# Altium schematic sheet DDS_channel.SchDoc: 9910 & 9912 DDS
size 420 x 297 mm; Author: G.K.; CompanyName: WUT; DrawnBy: G.K.; Organization: WUT ISE; Address1: Warsaw Univeristy of Technology; Address2: Nowowiejska 15/19; DocumentNumber: 5; Revision: -; SheetNumber: 5; SheetTotal: 7; EDA_Number: ARTIQ; Projet: ARTIQ/SINARA; ModifiedBy: -; CreateDate: XX/XX/XXXX; CheckedDate: -; DivGrp: ISE; Designer: G.K.; ModifiedDate: -; ProjectName: ARTIQ/SINARA
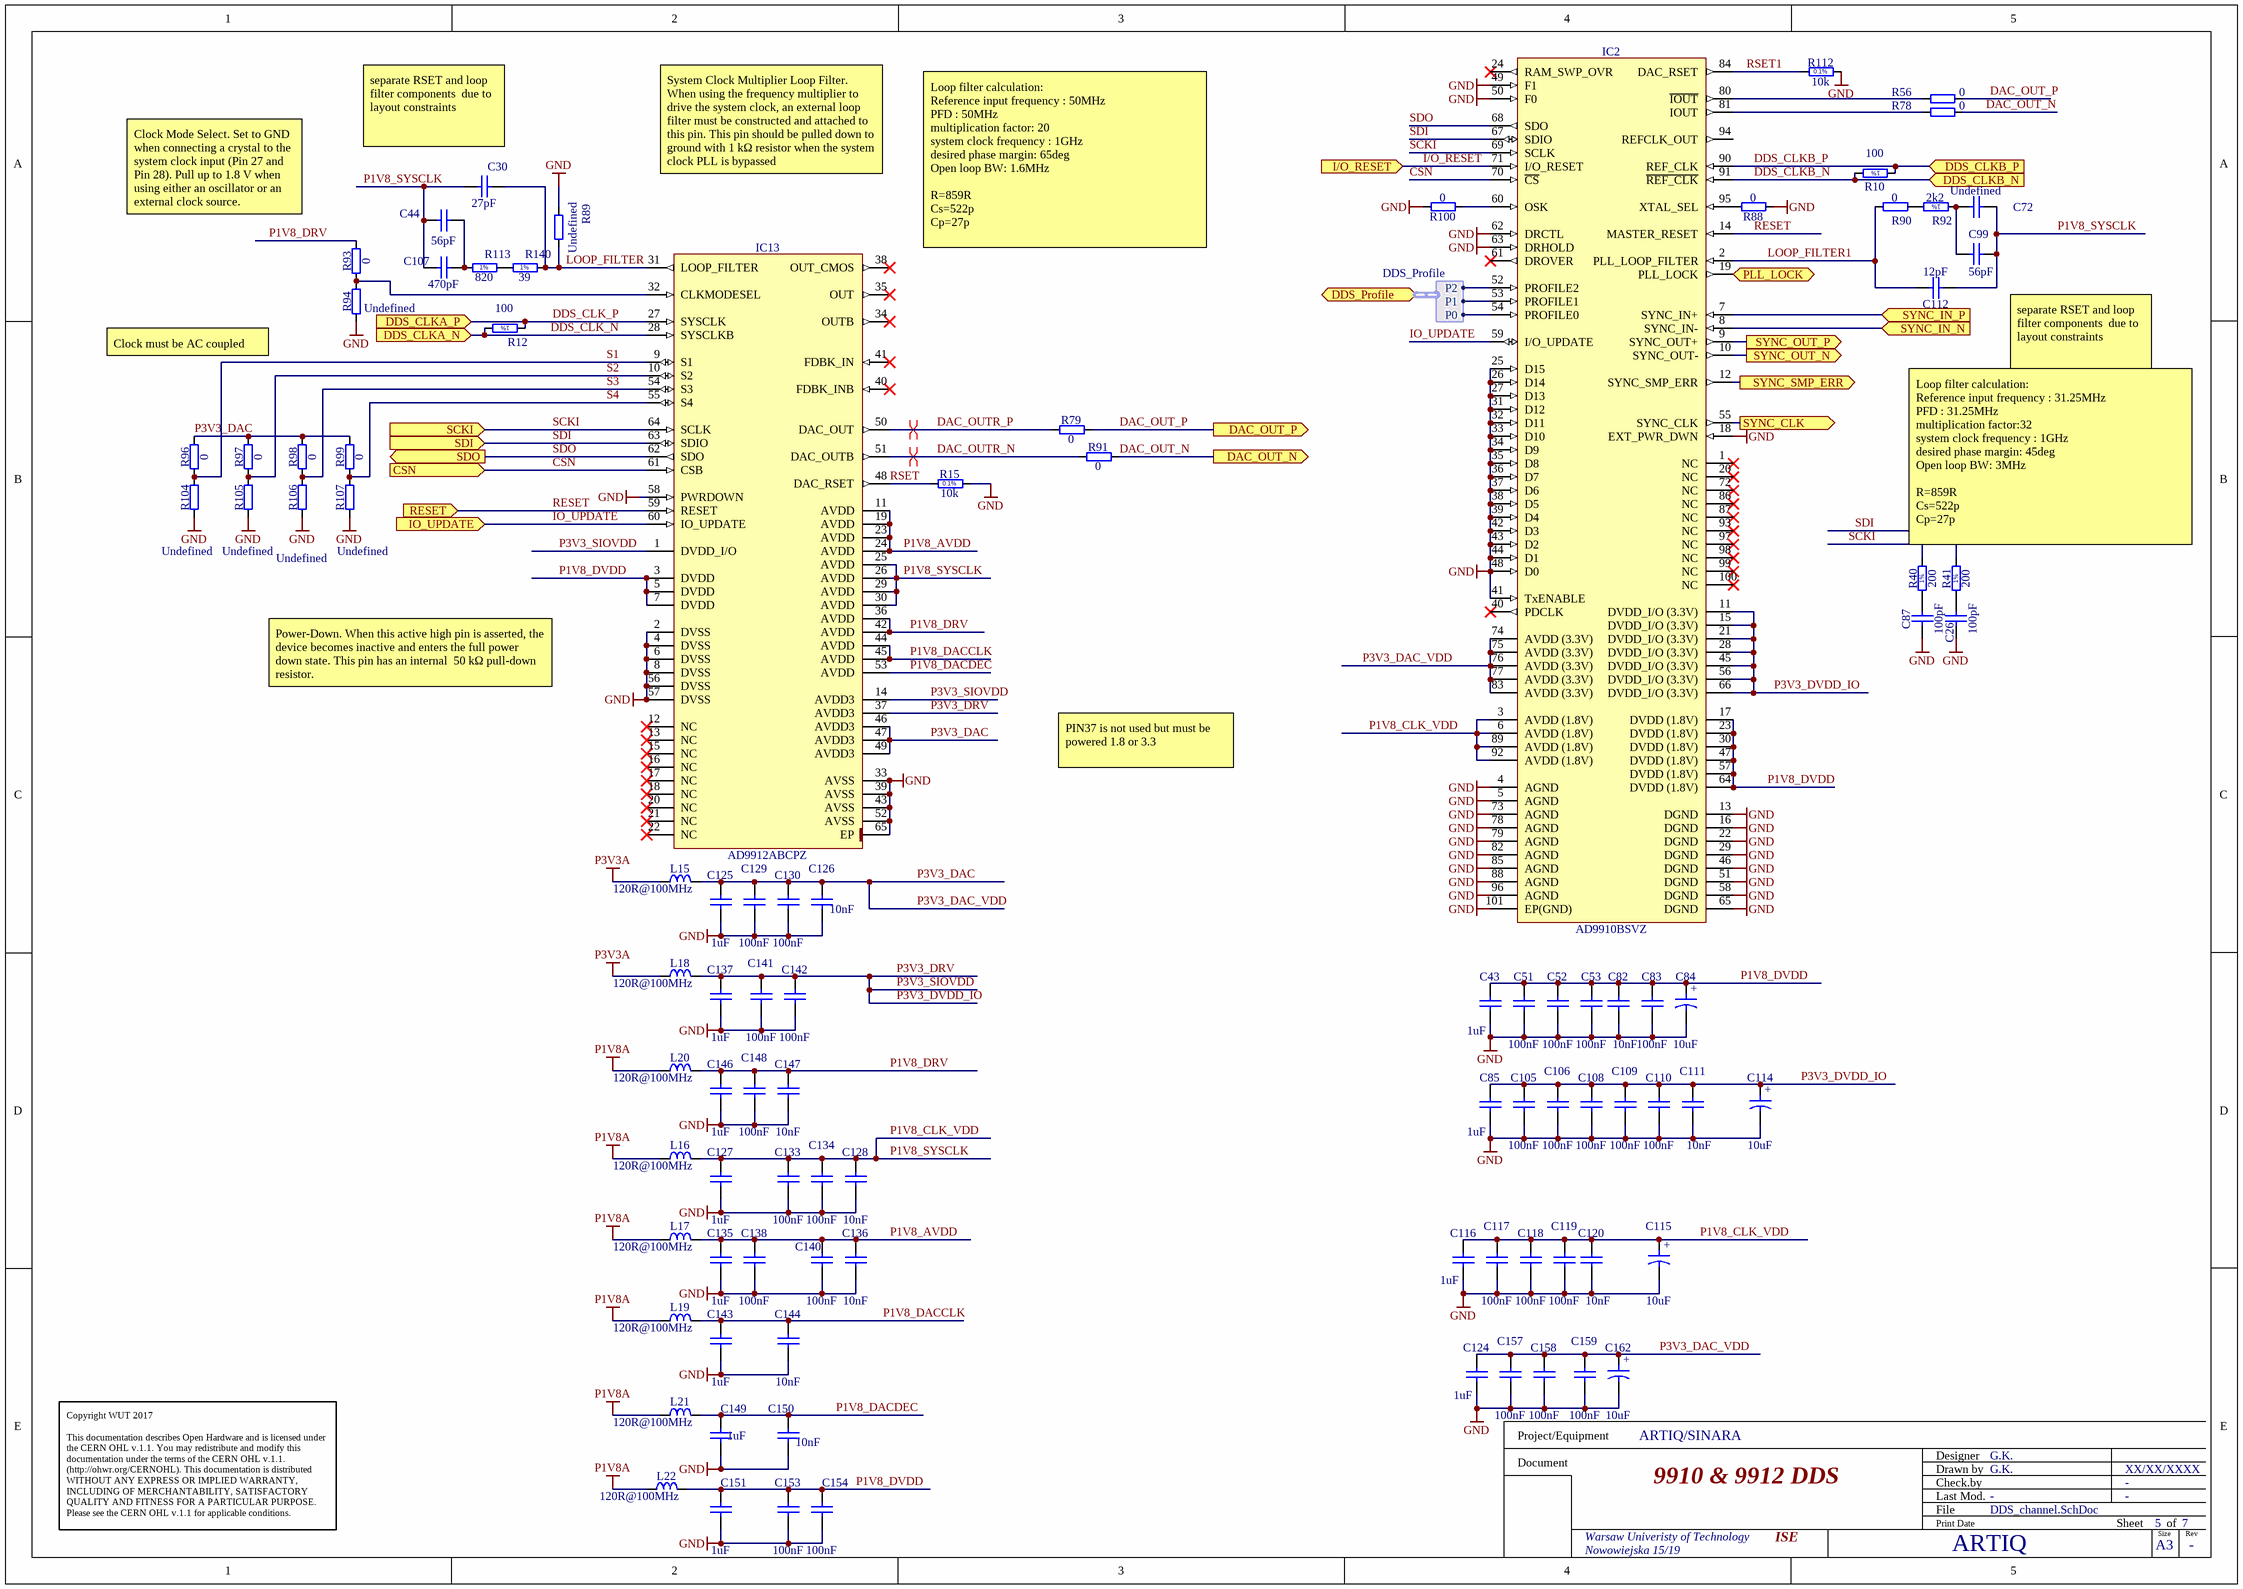
[diagram p0: DDS_channel.SchDoc]

## Parts
C26  100pF  [CAPC1005X55N]
C30  27pF  [CAPC1608X87N]
C43  1uF  [CAPC1005X55N]
C44  56pF  [CAPC1608X87N]
C51  100nF  [CAPC1005X55N]
C52  100nF  [CAPC1005X55N]
C53  100nF  [CAPC1005X55N]
C72  Undefined  [CAPC1608X90N]
C82  10nF  [CAPC1005X55N]
C83  100nF  [CAPC1005X55N]
C84  10uF  [CAPMP6032X280N]
C85  1uF  [CAPC1005X55N]
C87  100pF  [CAPC1005X55N]
C99  56pF  [CAPC1608X87N]
C105  100nF  [CAPC1005X55N]
C106  100nF  [CAPC1005X55N]
C107  470pF  [CAPC1608X87N]
C108  100nF  [CAPC1005X55N]
C109  100nF  [CAPC1005X55N]
C110  100nF  [CAPC1005X55N]
C111  10nF  [CAPC1005X55N]
C112  12pF  [CAPC1608X87N]
C114  10uF  [CAPMP6032X280N]
C115  10uF  [CAPMP6032X280N]
C116  1uF  [CAPC1005X55N]
C117  100nF  [CAPC1005X55N]
C118  100nF  [CAPC1005X55N]
C119  100nF  [CAPC1005X55N]
C120  10nF  [CAPC1005X55N]
C124  1uF  [CAPC1005X55N]
C125  1uF  [CAPC1005X55N]
C126  10nF  [CAPC1005X55N]
C127  1uF  [CAPC1005X55N]
C128  10nF  [CAPC1005X55N]
C129  100nF  [CAPC1005X55N]
C130  100nF  [CAPC1005X55N]
C133  100nF  [CAPC1005X55N]
C134  100nF  [CAPC1005X55N]
C135  1uF  [CAPC1005X55N]
C136  10nF  [CAPC1005X55N]
C137  1uF  [CAPC1005X55N]
C138  100nF  [CAPC1005X55N]
C140  100nF  [CAPC1005X55N]
C141  100nF  [CAPC1005X55N]
C142  100nF  [CAPC1005X55N]
C143  1uF  [CAPC1005X55N]
C144  10nF  [CAPC1005X55N]
C146  1uF  [CAPC1005X55N]
C147  10nF  [CAPC1005X55N]
C148  100nF  [CAPC1005X55N]
C149  1uF  [CAPC1005X55N]
C150  10nF  [CAPC1005X55N]
C151  1uF  [CAPC1005X55N]
C153  100nF  [CAPC1005X55N]
C154  100nF  [CAPC1005X55N]
C157  100nF  [CAPC1005X55N]
C158  100nF  [CAPC1005X55N]
C159  100nF  [CAPC1005X55N]
C162  10uF  [CAPMP6032X280N]
IC2  AD9910BSVZ  [QFP50P1600X1600X120-101N-S500]
IC13  AD9912ABCPZ  [QFN50P900X900X100-65N-S536]
L15  120R@100MHz  [INDC1608X95N]
L16  120R@100MHz  [INDC1608X95N]
L17  120R@100MHz  [INDC1608X95N]
L18  120R@100MHz  [INDC1608X95N]
L19  120R@100MHz  [INDC1608X95N]
L20  120R@100MHz  [INDC1608X95N]
L21  120R@100MHz  [INDC1608X95N]
L22  120R@100MHz  [INDC1608X95N]
R10  100  [RESC1005X40N]
R12  100  [RESC1005X40N]
R15  10k  [RESC1005X35N]
R40  200  [RESC1005X40N]
R41  200  [RESC1005X40N]
R56  0  [RESC1005X40N]
R78  0  [RESC1005X40N]
R79  0  [RESC1005X40N]
R88  0  [RESC1005X40N]
R89  Undefined  [RESC1005X40N]
R90  0  [RESC1608X55N]
R91  0  [RESC1005X40N]
R92  2k2  [RESC1608X55N]
R93  0  [RESC1005X40N]
R94  Undefined  [RESC1005X40N]
R96  0  [RESC1005X40N]
R97  0  [RESC1005X40N]
R98  0  [RESC1005X40N]
R99  0  [RESC1005X40N]
R100  0  [RESC1005X40N]
R104  Undefined  [RESC1005X40N]
R105  Undefined  [RESC1005X40N]
R106  Undefined  [RESC1005X40N]
R107  Undefined  [RESC1005X40N]
R112  10k  [RESC1005X35N]
R113  820  [RESC1608X55N]
R140  39  [RESC1608X55N]

## Ports
CSN (in), DAC_OUT_N (out), DAC_OUT_P (out), DDS_CLKA_N (in), DDS_CLKA_P (in), DDS_CLKB_N (in), DDS_CLKB_P (in), DDS_Profile (harness DDS_Profile), I/O_RESET (in), IO_UPDATE (in), PLL_LOCK (out), RESET (in), SCKI (in), SDI (in), SDO (out), SYNC_CLK (out), SYNC_IN_N (in), SYNC_IN_P (in), SYNC_OUT_N (out), SYNC_OUT_P (out), SYNC_SMP_ERR (out)

## Harnesses
DDS_Profile: P0, P1, P2

## Nets
GND: C26.1 C43.1 C51.1 C52.1 C53.1 C82.1 C83.1 C84.2 C85.1 C87.1 C105.1 C106.1 C108.1 C109.1 C110.1 C111.1 C114.2 C115.2 C116.1 C117.1 C118.1 C119.1 C120.1 C124.1 C125.1 C126.1 C127.1 C128.1 C129.1 C130.1 C133.1 C134.1 C135.1 C136.1 C137.1 C138.1 C140.1 C141.1 C142.1 C143.1 C144.1 C146.1 C147.1 C148.1 C149.1 C150.1 C151.1 C153.1 C154.1 C157.1 C158.1 C159.1 C162.2 IC2.4(AGND) IC2.5(AGND) IC2.13(DGND) IC2.16(DGND) IC2.18(EXT_PWR_DWN) IC2.22(DGND) IC2.25(D15) IC2.26(D14) IC2.27(D13) IC2.29(DGND) IC2.31(D12) IC2.32(D11) IC2.33(D10) IC2.34(D9) IC2.35(D8) IC2.36(D7) IC2.37(D6) IC2.38(D5) IC2.39(D4) IC2.41(TxENABLE) IC2.42(D3) IC2.43(D2) IC2.44(D1) IC2.46(DGND) IC2.48(D0) IC2.49(F1) IC2.50(F0) IC2.51(DGND) IC2.58(DGND) IC2.62(DRCTL) IC2.63(DRHOLD) IC2.65(DGND) IC2.73(AGND) IC2.78(AGND) IC2.79(AGND) IC2.82(AGND) IC2.85(AGND) IC2.88(AGND) IC2.96(AGND) IC2.101(EP(GND)) IC13.2(DVSS) IC13.4(DVSS) IC13.6(DVSS) IC13.8(DVSS) IC13.33(AVSS) IC13.39(AVSS) IC13.43(AVSS) IC13.52(AVSS) IC13.56(DVSS) IC13.57(DVSS) IC13.58(PWRDOWN) IC13.65(EP) R15.2 R88.1 R89.2 R94.1 R100.2 R104.1 R105.1 R106.1 R107.1 R112.2
P1V8A: L16.2 L17.2 L19.2 L20.2 L21.2 L22.2
P3V3A: L15.2 L18.2
CSN: IC2.70(~{CS}) IC13.61(CSB) ; port CSN
DAC_OUT_N: R78.2 R91.2 ; port DAC_OUT_N
DAC_OUT_P: R56.2 R79.2 ; port DAC_OUT_P
DAC_OUTR_N: IC13.51(DAC_OUTB) R91.1
DAC_OUTR_P: IC13.50(DAC_OUT) R79.1
DDS_CLK_N: IC13.28(SYSCLKB) R12.2 ; port DDS_CLKA_N
DDS_CLK_P: IC13.27(SYSCLK) R12.1 ; port DDS_CLKA_P
DDS_CLKB_N: IC2.91(~{REF_CLK}) R10.2 ; port DDS_CLKB_N
DDS_CLKB_P: IC2.90(REF_CLK) R10.1 ; port DDS_CLKB_P
I/O_RESET: IC2.71(I/O_RESET) ; port I/O_RESET
IO_UPDATE: IC2.59(I/O_UPDATE) IC13.60(IO_UPDATE) ; port IO_UPDATE
LOOP_FILTER: C30.2 IC13.31(LOOP_FILTER) R89.1 R140.2
LOOP_FILTER1: C112.2 IC2.2(PLL_LOOP_FILTER) R90.2
P1V8_AVDD: C135.2 C136.2 C138.2 C140.2 IC13.11(AVDD) IC13.19(AVDD) IC13.23(AVDD) IC13.24(AVDD) L17.1
P1V8_CLK_VDD: C30.1 C44.1 C72.1 C99.1 C107.1 C112.1 C115.1 C116.2 C117.2 C118.2 C119.2 C120.2 C127.2 C128.2 C133.2 C134.2 IC2.3(AVDD_(1.8V)) IC2.6(AVDD_(1.8V)) IC2.89(AVDD_(1.8V)) IC2.92(AVDD_(1.8V)) IC13.25(AVDD) IC13.26(AVDD) IC13.29(AVDD) IC13.30(AVDD) L16.1  [also labelled P1V8_SYSCLK]
P1V8_DACCLK: C143.2 C144.2 IC13.44(AVDD) IC13.45(AVDD) L19.1
P1V8_DACDEC: C149.2 C150.2 IC13.53(AVDD) L21.1
P1V8_DRV: C146.2 C147.2 C148.2 IC13.36(AVDD) IC13.42(AVDD) L20.1 R93.2
P1V8_DVDD: C43.2 C51.2 C52.2 C53.2 C82.2 C83.2 C84.1 C151.2 C153.2 C154.2 IC2.17(DVDD_(1.8V)) IC2.23(DVDD_(1.8V)) IC2.30(DVDD_(1.8V)) IC2.47(DVDD_(1.8V)) IC2.57(DVDD_(1.8V)) IC2.64(DVDD_(1.8V)) IC13.3(DVDD) IC13.5(DVDD) IC13.7(DVDD) L22.1
P3V3_DAC: C124.2 C125.2 C126.2 C129.2 C130.2 C157.2 C158.2 C159.2 C162.1 IC2.74(AVDD_(3.3V)) IC2.75(AVDD_(3.3V)) IC2.76(AVDD_(3.3V)) IC2.77(AVDD_(3.3V)) IC2.83(AVDD_(3.3V)) IC13.46(AVDD3) IC13.47(AVDD3) IC13.49(AVDD3) L15.1 R96.2 R97.2 R98.2 R99.2  [also labelled P3V3_DAC_VDD]
P3V3_DRV: C85.2 C105.2 C106.2 C108.2 C109.2 C110.2 C111.2 C114.1 C137.2 C141.2 C142.2 IC2.11(DVDD_I/O_(3.3V)) IC2.15(DVDD_I/O_(3.3V)) IC2.21(DVDD_I/O_(3.3V)) IC2.28(DVDD_I/O_(3.3V)) IC2.45(DVDD_I/O_(3.3V)) IC2.56(DVDD_I/O_(3.3V)) IC2.66(DVDD_I/O_(3.3V)) IC13.1(DVDD_I/O) IC13.14(AVDD3) IC13.37(AVDD3) L18.1  [also labelled P3V3_DVDD_IO, P3V3_SIOVDD]
PLL_LOCK: IC2.19(PLL_LOCK) ; port PLL_LOCK
RESET: IC2.14(MASTER_RESET) IC13.59(RESET) ; port RESET
RSET: IC13.48(DAC_RSET) R15.1
RSET1: IC2.84(DAC_RSET) R112.1
S1: IC13.9(S1) R96.1 R104.2
S2: IC13.10(S2) R97.1 R105.2
S3: IC13.54(S3) R98.1 R106.2
S4: IC13.55(S4) R99.1 R107.2
SCKI: IC2.69(SCLK) IC13.64(SCLK) R40.2 ; port SCKI
SDI: IC2.67(SDIO) IC13.63(SDIO) R41.2 ; port SDI
SDO: IC2.68(SDO) IC13.62(SDO) ; port SDO
SYNC_CLK: IC2.55(SYNC_CLK) ; port SYNC_CLK
SYNC_IN_N: IC2.8(SYNC_IN-) ; port SYNC_IN_N
SYNC_IN_P: IC2.7(SYNC_IN+) ; port SYNC_IN_P
SYNC_OUT_N: IC2.10(SYNC_OUT-) ; port SYNC_OUT_N
SYNC_OUT_P: IC2.9(SYNC_OUT+) ; port SYNC_OUT_P
SYNC_SMP_ERR: IC2.12(SYNC_SMP_ERR) ; port SYNC_SMP_ERR
NetC26_2: C26.2 R41.1
NetC44_2: C44.2 C107.2 R113.1
NetC72_2: C72.2 C99.2 R92.1
NetC87_2: C87.2 R40.1
NetIC2_52: IC2.52(PROFILE2) ; port DDS_Profile.P2
NetIC2_53: IC2.53(PROFILE1) ; port DDS_Profile.P1
NetIC2_54: IC2.54(PROFILE0) ; port DDS_Profile.P0
NetIC2_60: IC2.60(OSK) R100.1
NetIC2_80: IC2.80(~{IOUT}) R56.1
NetIC2_81: IC2.81(IOUT) R78.1
NetIC2_95: IC2.95(XTAL_SEL) R88.2
NetIC13_32: IC13.32(CLKMODESEL) R93.1 R94.2
NetR90_1: R90.1 R92.2
NetR113_2: R113.2 R140.1

Not connected (* = marked no-connect by the designer): IC2 1(NC)* 20(NC)* 24(RAM_SWP_OVR)* 40(PDCLK)* 61(DROVER)* 72(NC)* 86(NC)* 87(NC)* 93(NC)* 94(REFCLK_OUT) 97(NC)* 98(NC)* 99(NC)* 100(NC)*; IC13 12(NC)* 13(NC)* 15(NC)* 16(NC)* 17(NC)* 18(NC)* 20(NC)* 21(NC)* 22(NC)* 34(OUTB)* 35(OUT)* 38(OUT_CMOS)* 40(FDBK_INB)* 41(FDBK_IN)*

## Layout directives
differential pair: DAC_OUTR_N, DAC_OUTR_P

## Notes on the sheet
- (near C30) separate RSET and loop filter components  due to layout constraints
- System Clock Multiplier Loop Filter. When using the frequency multiplier to drive the system clock, an external loop filter must be constructed and attached to this pin. This pin should be pulled down to ground with 1 kΩ resistor when the system clock PLL is bypassed
- Clock Mode Select. Set to GND when connecting a crystal to the system clock input (Pin 27 and Pin 28). Pull up to 1.8 V when using either an oscillator or an external clock source.
- Loop filter calculation:
  Reference input frequency : 50MHz
  PFD : 50MHz
  multiplication factor: 20
  system clock frequency : 1GHz
  desired phase margin: 65deg
  Open loop BW: 1.6MHz
  R=859R
  Cs=522p
  Cp=27p
- Clock must be AC coupled
- separate RSET and loop filter components  due to layout constraints
- Loop filter calculation:
  Reference input frequency : 31.25MHz
  PFD : 31.25MHz
  multiplication factor:32
  system clock frequency : 1GHz
  desired phase margin: 45deg
  Open loop BW: 3MHz
  R=859R
  Cs=522p
  Cp=27p
- Power-Down. When this active high pin is asserted, the device becomes inactive and enters the full power down state. This pin has an internal  50 kΩ pull-down resistor.
- PIN37 is not used but must be powered 1.8 or 3.3
- Copyright WUT 2017
  This documentation describes Open Hardware and is licensed under the CERN OHL v.1.1. You may redistribute and modify this documentation under the terms of the CERN OHL v.1.1. (http://ohwr.org/CERNOHL). This documentation is distributed WITHOUT ANY EXPRESS OR IMPLIED WARRANTY, INCLUDING OF MERCHANTABILITY, SATISFACTORY QUALITY AND FITNESS FOR A PARTICULAR PURPOSE. Please see the CERN OHL v.1.1 for applicable conditions.
- Project/Equipment
- Document
- Designer
- Drawn by
- Check.by
- File
- Last Mod.
- Print Date
- Sheet
- Size
- A3
- of
- Rev
- (in symbol CTE6032-28_10UF_25V_10%_LESR0500) +
- (in symbol R0402_10K_0.1%_0.063W_25PPM) 0.1%
- (in symbol R0402_100R_1%_0.0625W_100PPM) 1%
- (in symbol R0402_200R_1%_0.0625W_100PPM) 1%
- (in symbol R0603_2k2_1%_0.1W_100PPM) 1%
- (in symbol R0603_39R_1%_0.1W_100PPM) 1%
- (in symbol R0603_820R_1%_0.1W_100PPM) 1%

## Library data of the parts
C26 C87 = CC0402_100PF_50V_5%_C0G: Non-polarised capacitor; Part Description: SMD Multilayer Chip Ceramic Capacitor; Manufacturer: GENERIC; Manufacturer1 Part Number: C0402C101J5GACTU; Voltage: 50V; TC: C0G/NP0; Tolerance: ±5%; Part Number: CC0402_100PF_50V_5%_C0G; Component Kind: Standard; Component Type: Standard; Pin Count: 2; Value: 100pF; Status: Preferred; Manufacturer Part Number: CC0402_100PF_50V_5%_C0G; Case: 0402; Mounted: Yes; Socket: No; SMD: Yes; Sense: No; Manufacturer1 Example: KEMET; Manufacturer1 ComponentHeight: 0.55mm; HelpURL: \\cern.ch\dfs\Applications\Altium\Datasheets\CC0805_C0G_KEMET_(Commercial Grade).pdf; Author: CERN DEM JLC; CreateDate: 03.12.2007; LatestRevisionDate: 22.04.2015
C30 = CC0603_27PF_50V_5%_NP0: Non-polarised capacitor; Part Description: SMD Multilayer Chip Ceramic Capacitor; Manufacturer: GENERIC; Manufacturer1 Part Number: 223886715279; Voltage: 50V; TC: C0G/NP0; Tolerance: ±5%; Part Number: CC0603_27PF_50V_5%_NP0; Component Kind: Standard; Component Type: Standard; Pin Count: 2; Value: 27pF; Status: Preferred; Manufacturer Part Number: CC0603_27PF_50V_5%_NP0; Case: 0603; Mounted: Yes; Socket: No; SMD: Yes; Sense: No; Manufacturer1 Example: PHYCOMP; Manufacturer1 ComponentHeight: 0.87mm; HelpURL: \\cern.ch\dfs\Applications\Altium\Datasheets\CC0603_NP0_PHYCOMP.pdf; Author: CERN DEM JLC; CreateDate: 03.12.2007; LatestRevisionDate: 03.12.2007
C43 C85 C116 C124 C125 C127 C135 C137 C143 C146 C149 C151 = CC0402_1UF_16V_10%_X5R: Non-polarised capacitor; Part Description: SMD Multilayer Chip Ceramic Capacitor; Manufacturer: GENERIC; Manufacturer1 Part Number: C1005X5R1C105KT; Voltage: 16V; TC: X5R; Tolerance: ±10%; Part Number: CC0402_1UF_16V_10%_X5R; Component Kind: Standard; Component Type: Standard; Pin Count: 2; Value: 1uF; Status: Preferred; Manufacturer Part Number: CC0402_1UF_16V_10%_X5R; Case: 0402; Mounted: Yes; Socket: No; SMD: Yes; Sense: No; Manufacturer1 Example: TDK; Manufacturer1 ComponentHeight: 0.55mm; HelpURL: \\cern.ch\dfs\Applications\Altium\Datasheets\CC0402_X5R_TDK_C.pdf; Author: CERN DEM JLC; CreateDate: 2012-10-25; LatestRevisionDate: 2012-10-25
C44 C99 = CC0603_56PF_50V_5%_NP0: Non-polarised capacitor; Part Description: SMD Multilayer Chip Ceramic Capacitor; Manufacturer: GENERIC; Manufacturer1 Part Number: 223886715569; Voltage: 50V; TC: C0G/NP0; Tolerance: ±5%; Part Number: CC0603_56PF_50V_5%_NP0; Component Kind: Standard; Component Type: Standard; Pin Count: 2; Value: 56pF; Status: Preferred; Manufacturer Part Number: CC0603_56PF_50V_5%_NP0; Case: 0603; Mounted: Yes; Socket: No; SMD: Yes; Sense: No; Manufacturer1 Example: PHYCOMP; Manufacturer1 ComponentHeight: 0.87mm; HelpURL: \\cern.ch\dfs\Applications\Altium\Datasheets\CC0603_NP0_PHYCOMP.pdf; Author: CERN DEM JLC; CreateDate: 03.12.2007; LatestRevisionDate: 03.12.2007
C51-C53 C83 C105 C106 C108-C110 C117-C119 C129 C130 C133 C134 C138 C140-C142 C148 C153 C154 C157-C159 = CC0402_100NF_16V_10%_X5R: Non-polarised capacitor; Part Description: SMD Multilayer Chip Ceramic Capacitor; Manufacturer: GENERIC; Manufacturer1 Part Number: GRM155R61C104KA88D; Voltage: 16V; TC: X5R; Tolerance: ±10%; Part Number: CC0402_100NF_16V_10%_X5R; Component Kind: Standard; Component Type: Standard; Pin Count: 2; Value: 100nF; Status: None; Manufacturer Part Number: CC0402_100NF_16V_10%_X5R; Case: 0402; Mounted: Yes; Socket: No; SMD: Yes; Sense: No; Manufacturer1 Example: MURATA; Manufacturer1 ComponentHeight: 0.55mm; HelpURL: \\cern.ch\dfs\Applications\Altium\Datasheets\CC0402_X5R_MURATA_GRM.pdf; Author: CERN DEM JLC; CreateDate: 10.12.2013; LatestRevisionDate: 10.12.2013
C72 = CC0603_NO-VALUE: Non-polarised capacitor; Part Description: Reserved Footprint For 0603(1608) Chip Ceramic Capacitor; Mounted: No; Part Number: CC0603_NO-VALUE; Component Kind: Standard; Component Type: Standard; Pin Count: 2; Value: Undefined; Status: None; Manufacturer: Undefined; Manufacturer Part Number: CC0603_NO-VALUE; Case: 0603; Socket: No; SMD: Yes; Sense: No; Manufacturer1 ComponentHeight: 0.9mm; HelpURL: Undefined; Author: CERN DEM MR; CreateDate: 22.11.2016; LatestRevisionDate: 22.11.2016
C82 C111 C120 C126 C128 C136 C144 C147 C150 = CC0402_10NF_16V_10%_X7R: Non-polarised capacitor; Part Description: SMD Multilayer Chip Ceramic Capacitor; Manufacturer: GENERIC; Manufacturer1 Part Number: 223878715636; Voltage: 16V; TC: X7R; Tolerance: ±10%; Part Number: CC0402_10NF_16V_10%_X7R; Component Kind: Standard; Component Type: Standard; Pin Count: 2; Value: 10nF; Status: Not Recommended; Manufacturer Part Number: CC0402_10NF_16V_10%_X7R; Case: 0402; Mounted: Yes; Socket: No; SMD: Yes; Sense: No; Manufacturer1 Example: PHYCOMP; Manufacturer1 ComponentHeight: 0.55mm; HelpURL: \\cern.ch\dfs\Applications\Altium\Datasheets\CC0402_X7R_PHYCOMP.pdf; Author: CERN DEM JLC; CreateDate: 2007-12-03; LatestRevisionDate: 2007-12-03
C84 C114 C115 C162 = CTE6032-28_10UF_25V_10%_LESR0500: Polarised capacitor; Part Description: Low ESR 0R5 Solid Tantalum Chip Capacitor; Manufacturer: GENERIC; Manufacturer1 Part Number: TPSC106K025R0500; Voltage: 25V; Tolerance: ±10%; Part Number: CTE6032-28_10UF_25V_10%_LESR0500; Component Kind: Standard; Component Type: Standard; Pin Count: 2; Value: 10uF; Status: Preferred; Manufacturer Part Number: CTE6032-28_10UF_25V_10%_LESR0500; Case: C; Mounted: Yes; Socket: No; SMD: Yes; Sense: No; Manufacturer1 Example: AVX; Manufacturer1 ComponentHeight: 2.8mm; HelpURL: \\cern.ch\dfs\Applications\Altium\Datasheets\CTE-LESR_AVX_TPS.pdf; Author: CERN DEM JLC; CreateDate: 05.05.2008; LatestRevisionDate: 20.01.2009
C107 = CC0603_470PF_50V_5%_NP0: Non-polarised capacitor; Part Description: SMD Multilayer Chip Ceramic Capacitor; Manufacturer: GENERIC; Manufacturer1 Part Number: 223886715471; Voltage: 50V; TC: C0G/NP0; Tolerance: ±5%; Part Number: CC0603_470PF_50V_5%_NP0; Component Kind: Standard; Component Type: Standard; Pin Count: 2; Value: 470pF; Status: Preferred; Manufacturer Part Number: CC0603_470PF_50V_5%_NP0; Case: 0603; Mounted: Yes; Socket: No; SMD: Yes; Sense: No; Manufacturer1 Example: PHYCOMP; Manufacturer1 ComponentHeight: 0.87mm; HelpURL: \\cern.ch\dfs\Applications\Altium\Datasheets\CC0603_NP0_PHYCOMP.pdf; Author: CERN DEM JLC; CreateDate: 03.12.2007; LatestRevisionDate: 03.12.2007
C112 = CC0603_12PF_50V_5%_NP0: Non-polarised capacitor; Part Description: SMD Multilayer Chip Ceramic Capacitor; Manufacturer: GENERIC; Manufacturer1 Part Number: 223886715129; Voltage: 50V; TC: C0G/NP0; Tolerance: ±5%; Part Number: CC0603_12PF_50V_5%_NP0; Component Kind: Standard; Component Type: Standard; Pin Count: 2; Value: 12pF; Status: Preferred; Manufacturer Part Number: CC0603_12PF_50V_5%_NP0; Case: 0603; Mounted: Yes; Socket: No; SMD: Yes; Sense: No; Manufacturer1 Example: PHYCOMP; Manufacturer1 ComponentHeight: 0.87mm; HelpURL: \\cern.ch\dfs\Applications\Altium\Datasheets\CC0603_NP0_PHYCOMP.pdf; Author: CERN DEM JLC; CreateDate: 03.12.2007; LatestRevisionDate: 03.12.2007
IC2 = AD9910BSVZ: 1 GSPS, 14-Bit, 3.3 V CMOS Direct Digital Synthesizer; Manufacturer: ANALOG DEVICES; PressFit: No; Bonding: No; Part Number: AD9910BSVZ; Component Kind: Standard; Component Type: Standard; Device: AD9910BSVZ; PackageDescription: QFP, 0.50mm pitch, Square; 100 pin, 14.00mm L X 14.00mm W X 1.20mm H body (w/thermal tab), IPC Medium Density; Part Description: 1 GSPS, 14-Bit, 3.3 V CMOS Direct Digital Synthesizer; Manufacturer Part Number: AD9910BSVZ; Pin Count: 101; Case: QFP100; Mounted: Yes; Socket: No; SMD: Yes; Sense: No; ComponentHeight: 1.2mm; Author: CERN DEM JLC; HelpURL: \\cern.ch\dfs\Applications\Altium\Datasheets\AD9910BSVZ.pdf; CreateDate: 24.11.2009; LatestRevisionDate: 24.11.2009
IC13 = AD9912ABCPZ: 1 GSPS Direct Digital Synthetizer with 14-Bit DAC; Manufacturer: ANALOG DEVICES; PressFit: No; Bonding: No; Part Number: AD9912ABCPZ; Component Kind: Standard; Component Type: Standard; Device: AD9912ABCPZ; PackageDescription: QFN, 0.50mm Pitch, Square; 64 Pin, 9.00mm L X 9.00mm W X 1.00mm H Body (5.36mm X 5.36mm Thermal Tab), IPC Medium Density; Part Description: 1 GSPS Direct Digital Synthetizer with 14-Bit DAC; Manufacturer Part Number: AD9912ABCPZ; Pin Count: 65; Case: QFN64; Mounted: Yes; Socket: No; SMD: Yes; Sense: No; ComponentHeight: 1mm; Author: CERN DEM JLC; HelpURL: \\cern.ch\dfs\Applications\Altium\Datasheets\AD9912ABCPZ.pdf; CreateDate: 04.02.2014; LatestRevisionDate: 04.02.2014
L15-L22 = IND0603_MURATA_BLM18PG121SN1D: Inductor; Part Description: SMD EMIFIL Chip Ferrite Bead; Manufacturer: MURATA; Power: 2A; Resistance: 0.05R; Part Number: IND0603_MURATA_BLM18PG121SN1D; Component Kind: Standard; Component Type: Standard; Pin Count: 2; Value: 120R@100MHz; Status: None; Manufacturer Part Number: BLM18PG121SN1D; Case: 0603; Mounted: Yes; Socket: No; SMD: Yes; Sense: No; ComponentHeight: 0.95mm; HelpURL: \\cern.ch\dfs\Applications\Altium\Datasheets\IND0603_MURATA_BLM18P.pdf; Author: CERN DEM BC; CreateDate: 2015-07-27; LatestRevisionDate: 2015-07-27
R10 R12 = R0402_100R_1%_0.0625W_100PPM: Resistor - 1%; Part Description: General Purpose Thick Film Chip Resistor; Manufacturer: GENERIC; Manufacturer1 Part Number: 232270671001L; TC: ±100ppm/°C; PressFit: No; Part Number: R0402_100R_1%_0.0625W_100PPM; Component Kind: Standard; Component Type: Standard; Pin Count: 2; Value: 100; Status: Not Recommended; Power: 0.0625W; Tolerance: ±1%; Manufacturer Part Number: R0402_100R_1%_0.0625W_100PPM; Case: 0402; Mounted: Yes; Sense: No; Socket: No; SMD: Yes; Manufacturer1 Example: YAGEO PHYCOMP; Manufacturer1 ComponentHeight: 0.4mm; HelpURL: \\cern.ch\dfs\Applications\Altium\Datasheets\R0402_Phycomp_RC0402.pdf; Author: CERN DEM JLC; CreateDate: 03.12.2007; LatestRevisionDate: 17.10.2012
R15 R112 = R0402_10K_0.1%_0.063W_25PPM: Resistor - 0.1%; Part Description: Thin Film Precision Resistor; Manufacturer: GENERIC; Manufacturer1 Part Number: CPF0402B10KE1; Power: 0.063W; TC: ±25ppm/°C; PressFit: No; Part Number: R0402_10K_0.1%_0.063W_25PPM; Component Kind: Standard; Component Type: Standard; Pin Count: 2; Value: 10k; Status: Not Recommended; Tolerance: ±0.1%; Manufacturer Part Number: R0402_10K_0.1%_0.063W_25PPM; Case: 0402; Mounted: Yes; Sense: No; Socket: No; SMD: Yes; Manufacturer1 Example: TE CONNECTIVITY; Manufacturer1 ComponentHeight: 0.35mm; HelpURL: \\cern.ch\dfs\Applications\Altium\Datasheets\R0402_TYCO_CPF.pdf; Author: CERN DEM JMW; CreateDate: 22.09.2015; LatestRevisionDate: 22.09.2015
R40 R41 = R0402_200R_1%_0.0625W_100PPM: Resistor - 1%; Part Description: General Purpose Thick Film Chip Resistor; Manufacturer: GENERIC; Manufacturer1 Part Number: 232270672001L; TC: ±100ppm/°C; PressFit: No; Part Number: R0402_200R_1%_0.0625W_100PPM; Component Kind: Standard; Component Type: Standard; Pin Count: 2; Value: 200; Status: Not Recommended; Power: 0.0625W; Tolerance: ±1%; Manufacturer Part Number: R0402_200R_1%_0.0625W_100PPM; Case: 0402; Mounted: Yes; Sense: No; Socket: No; SMD: Yes; Manufacturer1 Example: YAGEO PHYCOMP; Manufacturer1 ComponentHeight: 0.4mm; HelpURL: \\cern.ch\dfs\Applications\Altium\Datasheets\R0402_Phycomp_RC0402.pdf; Author: CERN DEM JLC; CreateDate: 03.12.2007; LatestRevisionDate: 17.10.2012
R56 R78 R79 R88 R91 R93 R96-R100 = R0402_0R_JUMPER: Resistor; Part Description: 1A (0.05R Max DC Resistance) Zero Ohm Jumper; Manufacturer: GENERIC; Manufacturer1 Part Number: 232270591001L; PressFit: No; Part Number: R0402_0R_JUMPER; Component Kind: Standard; Component Type: Standard; Pin Count: 2; Value: 0; Status: Not Recommended; Manufacturer Part Number: R0402_0R_JUMPER; Case: 0402; Mounted: Yes; Sense: No; Socket: No; SMD: Yes; Manufacturer1 Example: YAGEO PHYCOMP; Manufacturer1 ComponentHeight: 0.4mm; HelpURL: \\cern.ch\dfs\Applications\Altium\Datasheets\R0402_Phycomp_RC0402.pdf; Author: CERN DEM JLC; CreateDate: 03.12.2007; LatestRevisionDate: 17.10.2012
R89 R94 R104-R107 = R0402_NO-VALUE: Resistor; Part Description: Reserved Footprint For a 0402 (1005) Chip Resistor; Mounted: No; PressFit: No; Part Number: R0402_NO-VALUE; Component Kind: Standard; Component Type: Standard; Pin Count: 2; Value: Undefined; Status: None; Manufacturer: Undefined; Manufacturer Part Number: R0402_NO-VALUE; Case: 0402; Sense: No; Socket: No; SMD: Yes; Manufacturer1 Example: Undefined; Manufacturer1 Part Number: Undefined; Manufacturer1 ComponentHeight: Undefined; HelpURL: Undefined; Author: CERN DEM JLC; CreateDate: 03.12.2007; LatestRevisionDate: 13.03.2008
R90 = R0603_0R_JUMPER: Resistor; Part Description: 1A (0.05R Max DC Resistance) Zero Ohm Jumper; Manufacturer: GENERIC; Manufacturer1 Part Number: NRC06Z0; PressFit: No; Part Number: R0603_0R_JUMPER; Component Kind: Standard; Component Type: Standard; Pin Count: 2; Value: 0; Status: Preferred; Manufacturer Part Number: R0603_0R_JUMPER; Case: 0603; Mounted: Yes; Sense: No; Socket: No; SMD: Yes; Manufacturer1 Example: NIC COMPONENT; Manufacturer1 ComponentHeight: 0.55mm; HelpURL: \\cern.ch\dfs\Applications\Altium\Datasheets\R0603_NIC_NRC.pdf; Author: CERN DEM JLC; CreateDate: 03.12.2007; LatestRevisionDate: 13.03.2008
R92 = R0603_2k2_1%_0.1W_100PPM: Resistor - 1%; Part Description: General Purpose Thick Film Chip Resistor; Manufacturer: GENERIC; Manufacturer1 Part Number: NRC06F2201TRF; Power: 0.1W; TC: ±100ppm/°C; PressFit: No; Part Number: R0603_2K2_1%_0.1W_100PPM; Component Kind: Standard; Component Type: Standard; Pin Count: 2; Value: 2k2; Status: Preferred; Tolerance: ±1%; Manufacturer Part Number: R0603_2K2_1%_0.1W_100PPM; Case: 0603; Mounted: Yes; Sense: No; Socket: No; SMD: Yes; Manufacturer1 Example: NIC COMPONENT; Manufacturer1 ComponentHeight: 0.55mm; HelpURL: \\cern.ch\dfs\Applications\Altium\Datasheets\R0603_NIC_NRC.pdf; Author: CERN DEM JLC; CreateDate: 03.12.2007; LatestRevisionDate: 13.03.2008
R113 = R0603_820R_1%_0.1W_100PPM: Resistor - 1%; Part Description: General Purpose Thick Film Chip Resistor; Manufacturer: GENERIC; Manufacturer1 Part Number: NRC06F8200TRF; Power: 0.1W; TC: ±100ppm/°C; PressFit: No; Part Number: R0603_820R_1%_0.1W_100PPM; Component Kind: Standard; Component Type: Standard; Pin Count: 2; Value: 820; Status: Preferred; Tolerance: ±1%; Manufacturer Part Number: R0603_820R_1%_0.1W_100PPM; Case: 0603; Mounted: Yes; Sense: No; Socket: No; SMD: Yes; Manufacturer1 Example: NIC COMPONENT; Manufacturer1 ComponentHeight: 0.55mm; HelpURL: \\cern.ch\dfs\Applications\Altium\Datasheets\R0603_NIC_NRC.pdf; Author: CERN DEM JLC; CreateDate: 03.12.2007; LatestRevisionDate: 13.03.2008
R140 = R0603_39R_1%_0.1W_100PPM: Resistor - 1%; Part Description: General Purpose Thick Film Chip Resistor; Manufacturer: GENERIC; Manufacturer1 Part Number: NRC06F39R0TRF; Power: 0.1W; TC: ±100ppm/°C; PressFit: No; Part Number: R0603_39R_1%_0.1W_100PPM; Component Kind: Standard; Component Type: Standard; Pin Count: 2; Value: 39; Status: Preferred; Tolerance: ±1%; Manufacturer Part Number: R0603_39R_1%_0.1W_100PPM; Case: 0603; Mounted: Yes; Sense: No; Socket: No; SMD: Yes; Manufacturer1 Example: NIC COMPONENT; Manufacturer1 ComponentHeight: 0.55mm; HelpURL: \\cern.ch\dfs\Applications\Altium\Datasheets\R0603_NIC_NRC.pdf; Author: CERN DEM JLC; CreateDate: 03.12.2007; LatestRevisionDate: 13.03.2008